# Altium schematic sheet 1A21J11_J2_Rx_Internal_Connection.SchDoc: Cable Assembly
size A; Date: 1/1/17; CompanyName: National Center for Atmospheric Research; DrawnBy: Rich Erickson; Engineer: 4/21/17; Organization: Earth Observing Laboratory; Address1: 3450 Mitchell Lane; Address2: FL1; Address3: 3090 Center Green Dr.; Address4: Boulder, CO. 80301; DocumentNumber: 1A20J19_1A21J11; Revision: B; SheetNumber: 1; SheetTotal: 1; Department: Remote Sensing Facility; ModifiedDate: 7/17/97; ImagePath: 4/21/17; ProjectName: Ka Band; Application_BuildNumber: 5
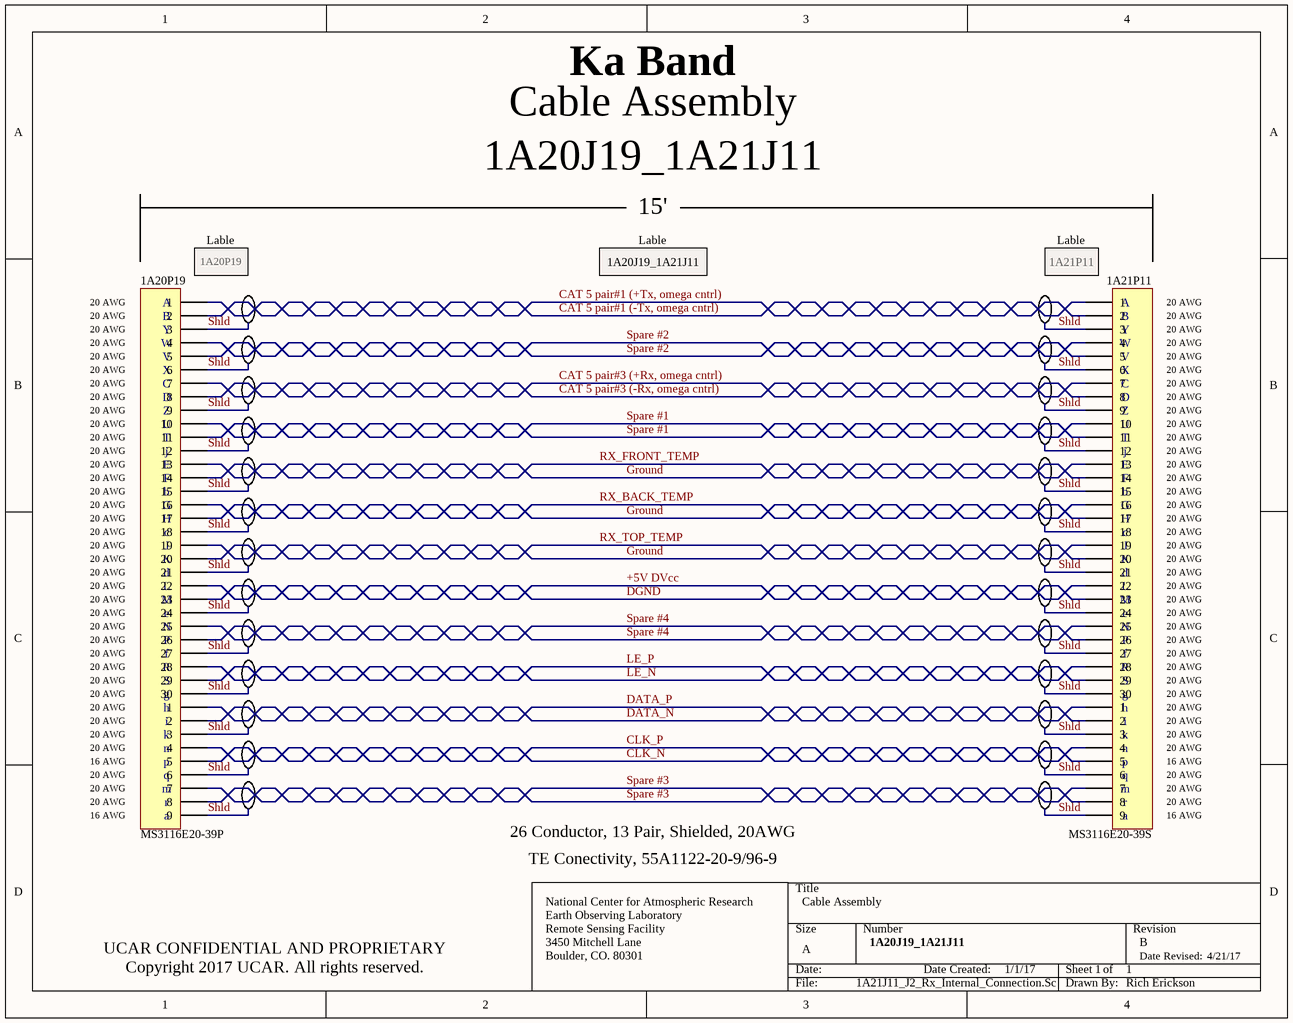
[diagram p0: 1A21J11_J2_Rx_Internal_Connection.SchDoc]

## Parts
1A20P19  MS3126E18-32P  [HDR1X30]  (value not drawn)
1A20P19a  MS3116E20-39P  [HDR1X9]
1A21P11  MS3126E18-32S  [HDR1X30]  (value not drawn)
1A21P11a  MS3116E20-39S  [HDR1X9]

## Nets
+5V DVcc: 1A20P19.22 1A21P11.22
CAT 5 pair#1 (+Tx, omega cntrl): 1A20P19.1 1A21P11.1
CAT 5 pair#1 (-Tx, omega cntrl): 1A20P19.2 1A21P11.2
CAT 5 pair#3 (+Rx, omega cntrl): 1A20P19.7 1A21P11.7
CAT 5 pair#3 (-Rx, omega cntrl): 1A20P19.8 1A21P11.8
CLK_N: 1A20P19a.5 1A21P11a.5
CLK_P: 1A20P19a.4 1A21P11a.4
DATA_N: 1A20P19a.2 1A21P11a.2
DATA_P: 1A20P19a.1 1A21P11a.1
DGND: 1A20P19.23 1A21P11.23
Ground: 1A20P19.14 1A20P19.17 1A20P19.20 1A21P11.14 1A21P11.17 1A21P11.20
LE_N: 1A20P19.29 1A21P11.29
LE_P: 1A20P19.28 1A21P11.28
RX_BACK_TEMP: 1A20P19.16 1A21P11.16
RX_FRONT_TEMP: 1A20P19.13 1A21P11.13
RX_TOP_TEMP: 1A20P19.19 1A21P11.19
Shld: 1A20P19.3 1A20P19.6 1A20P19.9 1A20P19.12 1A20P19.15 1A20P19.18 1A20P19.21 1A20P19.24 1A20P19.27 1A20P19.30 1A20P19a.3 1A20P19a.6 1A20P19a.9 1A21P11.3 1A21P11.6 1A21P11.9 1A21P11.12 1A21P11.15 1A21P11.18 1A21P11.21 1A21P11.24 1A21P11.27 1A21P11.30 1A21P11a.3 1A21P11a.6 1A21P11a.9
Spare #1: 1A20P19.10 1A20P19.11 1A21P11.10 1A21P11.11
Spare #2: 1A20P19.4 1A20P19.5 1A21P11.4 1A21P11.5
Spare #3: 1A20P19a.7 1A20P19a.8 1A21P11a.7 1A21P11a.8
Spare #4: 1A20P19.25 1A20P19.26 1A21P11.25 1A21P11.26

## Notes on the sheet
- 15'
- 20 AWG
- (near 1A20P19) A
- (near 1A20P19) 1A20P19
- Lable
- 1A20J19_1A21J11
- (near 1A21P11) 1A21P11
- (near 1A21P11) A
- (near 1A20P19) B
- (near 1A20P19) V
- (near 1A20P19) W
- (near 1A20P19) X
- (near 1A20P19) Y
- (near 1A21P11) B
- (near 1A21P11) V
- (near 1A21P11) W
- (near 1A21P11) X
- (near 1A21P11) Y
- (near 1A20P19) C
- (near 1A20P19) T
- (near 1A20P19) U
- (near 1A20P19) Z
- (near 1A20P19) D
- (near 1A21P11) C
- (near 1A21P11) T
- (near 1A21P11) U
- (near 1A21P11) Z
- (near 1A21P11) D
- (near 1A20P19) E
- (near 1A20P19) F
- (near 1A20P19) G
- (near 1A20P19) b
- (near 1A20P19) j
- (near 1A21P11) E
- (near 1A21P11) F
- (near 1A21P11) G
- (near 1A21P11) b
- (near 1A21P11) j
- (near 1A20P19) H
- (near 1A20P19) J
- (near 1A20P19) K
- (near 1A20P19) c
- (near 1A20P19) d
- (near 1A21P11) H
- (near 1A21P11) J
- (near 1A21P11) K
- (near 1A21P11) c
- (near 1A21P11) d
- (near 1A20P19) L
- (near 1A20P19) M
- (near 1A20P19) N
- (near 1A20P19) P
- (near 1A20P19) e
- (near 1A21P11) L
- (near 1A21P11) M
- (near 1A21P11) N
- (near 1A21P11) P
- (near 1A21P11) e
- (near 1A20P19) R
- (near 1A20P19) S
- (near 1A20P19) f
- g
- h
- (near 1A21P11) R
- (near 1A21P11) S
- (near 1A21P11) f
- 16 AWG
- (near 1A20P19a) i
- (near 1A20P19a) k
- (near 1A20P19a) n
- (near 1A20P19a) p
- (near 1A20P19a) q
- (near 1A21P11a) i
- (near 1A21P11a) k
- (near 1A21P11a) n
- (near 1A21P11a) p
- (near 1A21P11a) q
- (near 1A20P19a) a
- (near 1A20P19a) m
- (near 1A20P19a) r
- 26 Conductor, 13 Pair, Shielded, 20AWG
- (near 1A21P11a) a
- (near 1A21P11a) m
- (near 1A21P11a) r
- TE Conectivity, 55A1122-20-9/96-9
- UCAR CONFIDENTIAL AND PROPRIETARY
  Copyright 2017 UCAR. All rights reserved.
- Date Created:
- Date Revised:

## Library data of the parts
1A20P19 1A21P11 = Header 30: Header, 30-Pin; LatestRevisionDate: 17-Jul-2002; LatestRevisionNote: Re-released for DXP Platform.; Publisher: Altium Limited
1A20P19a 1A21P11a = Header 9: Header, 9-Pin; LatestRevisionDate: 17-Jul-2002; LatestRevisionNote: Re-released for DXP Platform.; Publisher: Altium Limited